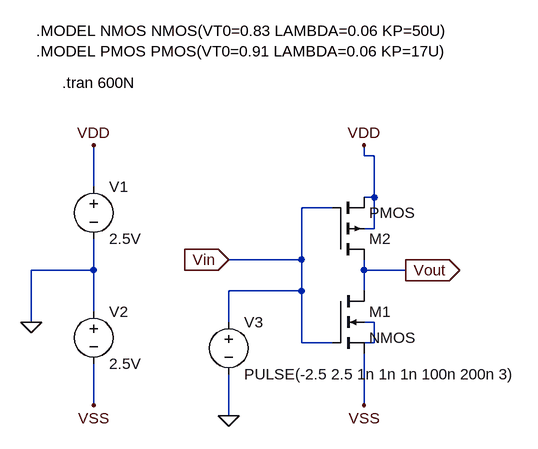
[diagram p0: schematic CMOS_Inverter.asc]
CMOS_Inverter.asc, the LTspice schematic file:
Version 4
SHEET 1 880 680
WIRE 240 0 240 -16
WIRE 256 0 240 0
WIRE -176 48 -176 -16
WIRE 256 64 256 0
WIRE 256 64 240 64
WIRE 192 80 144 80
WIRE 256 112 256 64
WIRE 256 112 240 112
WIRE 144 160 144 80
WIRE 144 160 32 160
WIRE -176 176 -176 128
WIRE -176 176 -272 176
WIRE 240 176 240 160
WIRE 304 176 240 176
WIRE 144 208 144 160
WIRE 144 208 32 208
WIRE 240 208 240 176
WIRE -176 240 -176 176
WIRE -272 256 -272 176
WIRE 32 256 32 208
WIRE 256 256 240 256
WIRE 144 288 144 208
WIRE 192 288 144 288
WIRE 256 288 256 256
WIRE 256 288 240 288
WIRE -176 384 -176 320
WIRE 240 384 240 304
WIRE 32 400 32 336
FLAG -272 256 0
FLAG -176 -16 VDD
FLAG 240 -16 VDD
FLAG -176 384 VSS
FLAG 240 384 VSS
FLAG 32 400 0
FLAG 32 160 Vin
IOPIN 32 160 In
FLAG 304 176 Vout
IOPIN 304 176 Out
SYMBOL nmos4 192 208 R0
SYMATTR InstName M1
SYMATTR Value2 l=5 w=15
SYMBOL pmos4 192 160 M180
SYMATTR InstName M2
SYMATTR Value2 l=5 w=30
SYMBOL voltage -176 32 R0
WINDOW 123 0 0 Left 2
WINDOW 39 0 0 Left 2
SYMATTR InstName V1
SYMATTR Value 2.5V
SYMBOL voltage -176 224 R0
WINDOW 123 0 0 Left 2
WINDOW 39 0 0 Left 2
SYMATTR InstName V2
SYMATTR Value 2.5V
SYMBOL voltage 32 240 R0
WINDOW 123 0 0 Left 2
WINDOW 39 0 0 Left 2
SYMATTR InstName V3
SYMATTR Value PULSE(-2.5 2.5 1n 1n 1n 100n 200n 3)
TEXT -264 -192 Left 2 !.MODEL NMOS NMOS(VT0=0.83 LAMBDA=0.06 KP=50U)\n.MODEL PMOS PMOS(VT0=0.91 LAMBDA=0.06 KP=17U)
TEXT -224 -112 Left 2 !.tran 600N

The netlist it stands for:
* CMOS_Inverter.asc
M1 Vout Vin VSS N001 NMOS l=5 w=15
M2 Vout Vin VDD VDD PMOS l=5 w=30
V1 VDD 0 2.5V
V2 0 VSS 2.5V
V3 Vin 0 PULSE(-2.5 2.5 1n 1n 1n 100n 200n 3)
.model NMOS NMOS
.model PMOS PMOS
.lib standard.mos
.MODEL NMOS NMOS(VT0=0.83 LAMBDA=0.06 KP=50U)
.MODEL PMOS PMOS(VT0=0.91 LAMBDA=0.06 KP=17U)
.tran 600N
.backanno
.end

* Results of the author's LTspice run, read from the files saved beside the schematic
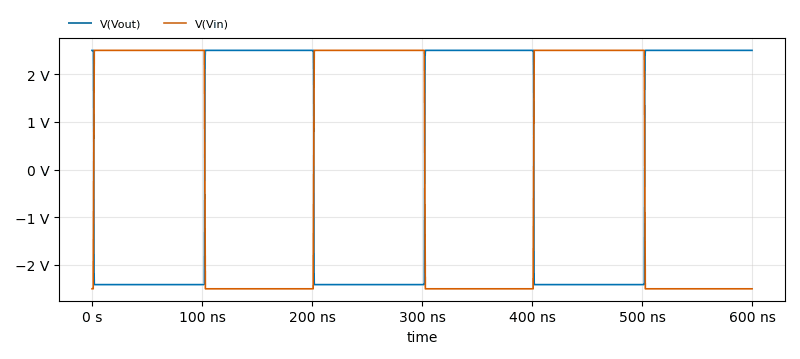
[diagram p1: Transient Analysis of CMOS_Inverter.asc, plotted from the saved traces]
* Transient Analysis, 1 run:
*   V(Vout): min -2.412 V, max 2.5 V, average 25.05 mV, rms 2.452 V, last 2.5 V
*   V(Vin): min -2.5 V, max 2.5 V, average 25 mV, rms 2.492 V, last -2.5 V